# EAGLE design jsbx 11 main (EAGLE 6.2)
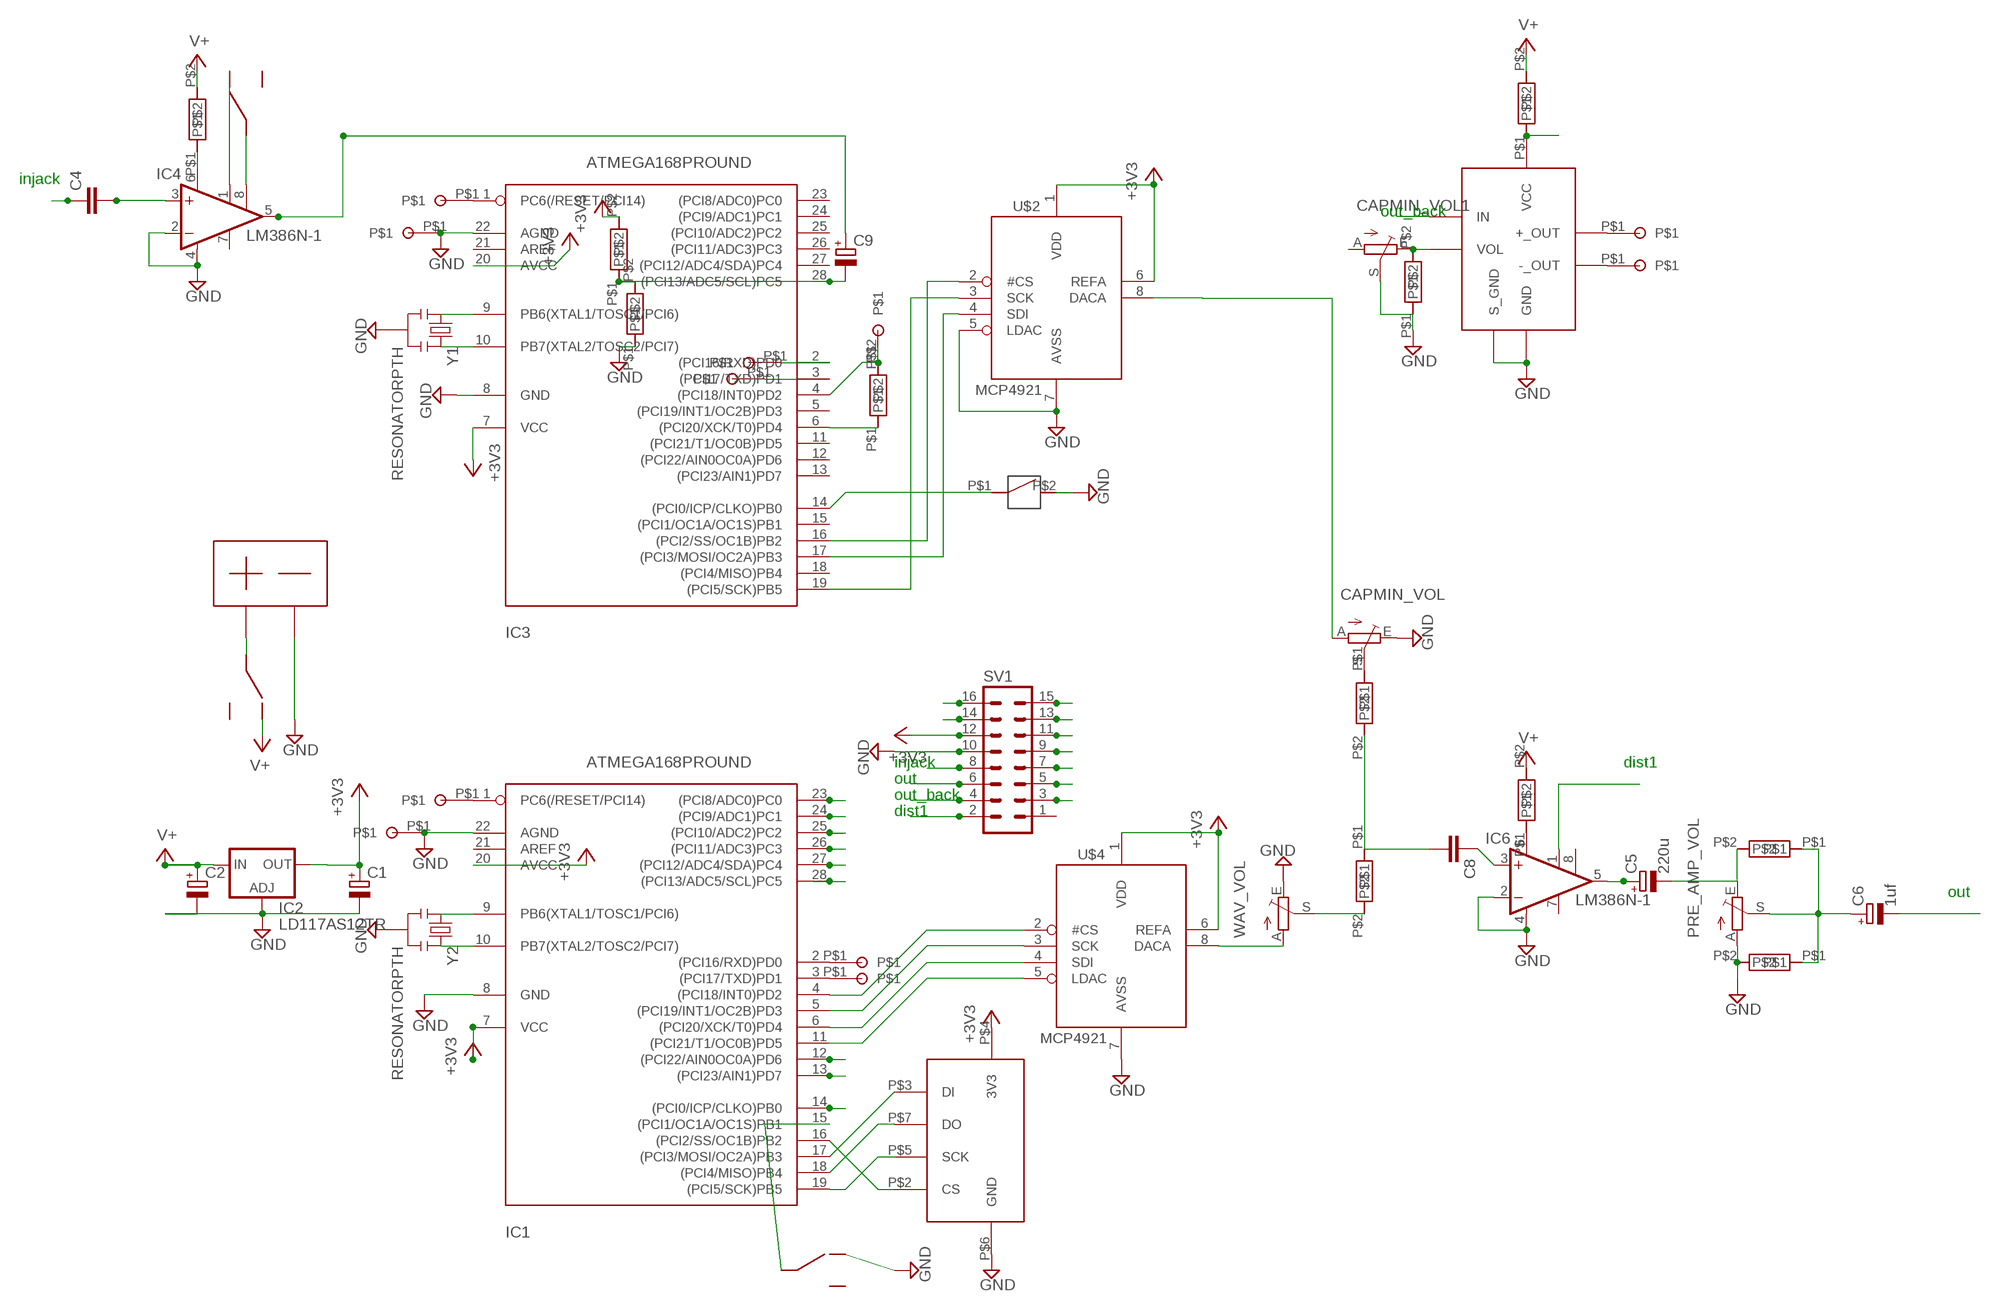
[diagram p0: schematic, sheet 1]

## Parts
C1  CPOL-EUE2-5  [E2-5]
C2  CPOL-EUE2-5  [E2-5]
C4  C-EU025-030X050  [C025-030X050]
C5  220u  CPOL-EUE2-5  [E2-5]
C6  1uf  CPOL-EUE2-5  [E2-5]
C8  C-EU025-030X050  [C025-030X050]
C9  CPOL-EUE2-5  [E2-5]
CAPMIN_VOL  TRIM_EU-CA9H  [CA9H]
CAPMIN_VOL1  TRIM_EU-CA9H  [CA9H]
IC1  ATMEGA168PROUND  [DIL28-3-ROUND]
IC2  LD117AS12TR  [SOT223]
IC3  ATMEGA168PROUND  [DIL28-3-ROUND]
IC4  LM386N-1  [DIL08]
IC6  LM386N-1  [DIL08]
PRE_AMP_VOL  TRIM_EU-CA9H  [CA9H]
R1  RESISTOR_PERP  [RESISTOR_PERP]
R2  RESISTOR_PERP  [RESISTOR_PERP]
R3  in_386_+  RESISTOR_PERP  [RESISTOR_PERP]
R4  10K  RESISTOR_PERP  [RESISTOR_PERP]
R4_DIS_386_+  RESISTOR_PERP  [RESISTOR_PERP]
R5  RESISTOR_PERP  [RESISTOR_PERP]
R6  RESISTOR_PERP  [RESISTOR_PERP]
R7  RESISTOR_PERP  [RESISTOR_PERP]
R8  RESISTOR_PERP  [RESISTOR_PERP]
R12-DIS_386_+1  RESISTOR_PERP  [RESISTOR_PERP]
R13-7052+  RESISTOR_PERP  [RESISTOR_PERP]
SV1  MA08-2  [MA08-2]
U$1  SD_MICRO_PERP  [SD_MICRO_PERP]
U$2  MCP4921  [DIL08]
U$3  TDA7052  [DIP8]
U$4  MCP4921  [DIL08]
U$5  SLIDE_HORIZ_OS  [SLIDE_HORIZ_OS]
U$6  12MM_TAC_HORIZ  [12MM_TAC_HORIZ]
U$7  PADSMALL  [PADSMALL]
U$8  PADSMALL  [PADSMALL]
U$9  PADSMALL  [PADSMALL]
U$10  PADSMALL  [PADSMALL]
U$11  PADSMALL  [PADSMALL]
U$12  PADSMALL  [PADSMALL]
U$13  PADSMALL  [PADSMALL]
U$14  PADSMALL  [PADSMALL]
U$15  PADSMALL  [PADSMALL]
U$16  SLIDE_HORIZ_OS  [SLIDE_HORIZ_OS]
U$17  SLIDE_HORIZ_OS  [SLIDE_HORIZ_OS]
U$18  9V  [9V]
U$22  PADSMALL  [PADSMALL]
U$23  PADSMALL  [PADSMALL]
WAV_VOL  TRIM_EU-CA9H  [CA9H]
Y1  RESONATORPTH  [RESONATOR-PTH]
Y2  RESONATORPTH  [RESONATOR-PTH]

## Nets
+3V3: C1.+ IC1.7(VCC) IC1.20(AVCC) IC2.4(OUT) IC3.7(VCC) IC3.20(AVCC) R2.P$2 SV1.12 U$1.P$4(3V3) U$2.1(VDD) U$2.6(REFA) U$4.1(VDD) U$4.6(REFA)
B1: IC1.28((PCI13/ADC5/SCL)PC5) SV1.14
DIST1: IC6.1(GAIN) SV1.2
GND: C1.- C2.- CAPMIN_VOL1.S CAPMIN_VOL.E IC1.8(GND) IC1.22(AGND) IC2.1(ADJ) IC3.8(GND) IC3.22(AGND) IC4.2(-IN) IC4.4(GND) IC6.2(-IN) IC6.4(GND) PRE_AMP_VOL.A R1.P$1 R6.P$2 R12-DIS_386_+1.P$1 SV1.10 U$1.P$6(GND) U$2.5(LDAC) U$2.7(AVSS) U$3.P$3(S_GND) U$3.P$6(GND) U$4.7(AVSS) U$6.P$2 U$11.P$1 U$13.P$1 U$16.P$2 U$18.P$2 WAV_VOL.E Y1.2 Y2.2
GPOT: IC1.23((PCI8/ADC0)PC0) SV1.9
IN_JACK: C4.1 SV1.8
N$1: IC1.10(PB7(XTAL2/TOSC2/PCI7)) Y2.3
N$2: IC1.9(PB6(XTAL1/TOSC1/PCI6)) Y2.1
N$3: IC3.10(PB7(XTAL2/TOSC2/PCI7)) Y1.3
N$4: IC3.9(PB6(XTAL1/TOSC1/PCI6)) Y1.1
N$5: IC1.18((PCI4/MISO)PB4) U$1.P$7(DO)
N$6: IC1.17((PCI3/MOSI/OC2A)PB3) U$1.P$3(DI)
N$7: IC1.19((PCI5/SCK)PB5) U$1.P$5(SCK)
N$8: IC1.16((PCI2/SS/OC1B)PB2) U$1.P$2(CS)
N$9: IC1.15((PCI1/OC1A/OC1S)PB1) U$16.P$1
N$10: IC1.4((PCI18/INT0)PD2) U$4.2(#CS)
N$11: IC1.5((PCI19/INT1/OC2B)PD3) U$4.3(SCK)
N$12: IC1.6((PCI20/XCK/T0)PD4) U$4.4(SDI)
N$13: IC1.11((PCI21/T1/OC0B)PD5) U$4.5(LDAC)
N$14: C8.1 IC6.3(+IN)
N$15: R8.P$2 WAV_VOL.S
N$16: IC4.6(VS) R3.P$1
N$17: IC1.2((PCI16/RXD)PD0) U$14.P$1
N$18: IC1.24((PCI9/ADC1)PC1) SV1.11
N$19: IC1.25((PCI10/ADC2)PC2) SV1.13
N$20: IC1.26((PCI11/ADC3)PC3) SV1.15
N$21: R13-7052+.P$1 U$3.P$1(VCC)
N$22: CAPMIN_VOL1.E R12-DIS_386_+1.P$2 U$3.P$4(VOL)
N$23: C9.- IC3.28((PCI13/ADC5/SCL)PC5) R1.P$2 R2.P$1
N$24: IC1.27((PCI12/ADC4/SDA)PC4) SV1.16
N$25: IC1.12((PCI22/AIN0OC0A)PD6) SV1.7
N$26: IC1.13((PCI23/AIN1)PD7) SV1.5
N$27: C4.2 IC4.3(+IN)
N$28: U$3.P$8(-_OUT) U$22.P$1
N$29: C8.2 R4.P$2 R8.P$1
N$30: IC4.1(GAIN) U$5.P$2
N$31: U$17.P$1 U$18.P$1
N$32: IC1.14((PCI0/ICP/CLKO)PB0) SV1.3
N$33: C5.- PRE_AMP_VOL.E R5.P$2
N$34: IC3.16((PCI2/SS/OC1B)PB2) U$2.2(#CS)
N$35: IC3.17((PCI3/MOSI/OC2A)PB3) U$2.4(SDI)
N$36: IC3.19((PCI5/SCK)PB5) U$2.3(SCK)
N$37: IC6.6(VS) R4_DIS_386_+.P$1
N$38: C5.+ IC6.5(OUT)
N$39: IC3.14((PCI0/ICP/CLKO)PB0) U$6.P$1
N$40: C9.+ IC4.5(OUT)
N$41: CAPMIN_VOL.A U$2.8(DACA)
N$42: IC3.1(PC6(/RESET/PCI14)) U$8.P$1
N$43: IC3.2((PCI16/RXD)PD0) U$9.P$1
N$44: IC3.3((PCI17/TXD)PD1) U$10.P$1
N$45: IC1.1(PC6(/RESET/PCI14)) U$12.P$1
N$46: IC1.3((PCI17/TXD)PD1) U$15.P$1
N$47: IC3.4((PCI18/INT0)PD2) R7.P$2 U$7.P$1
N$48: IC3.6((PCI20/XCK/T0)PD4) R7.P$1
N$49: U$3.P$5(+_OUT) U$23.P$1
N$50: IC4.8(GAIN) U$5.P$1
N$51: U$4.8(DACA) WAV_VOL.A
N$52: C6.+ PRE_AMP_VOL.S R5.P$1 R6.P$1
N$53: CAPMIN_VOL.S R4.P$1
OUT: C6.- SV1.6
OUT_BACK: SV1.4 U$3.P$2(IN)
V+: C2.+ IC2.3(IN) R3.P$2 R4_DIS_386_+.P$2 R13-7052+.P$2 U$17.P$2
Unconnected: CAPMIN_VOL1.A IC1.21(AREF) IC3.5((PCI19/INT1/OC2B)PD3) IC3.11((PCI21/T1/OC0B)PD5) IC3.12((PCI22/AIN0OC0A)PD6) IC3.13((PCI23/AIN1)PD7) IC3.15((PCI1/OC1A/OC1S)PB1) IC3.18((PCI4/MISO)PB4) IC3.21(AREF) IC3.23((PCI8/ADC0)PC0) IC3.24((PCI9/ADC1)PC1) IC3.25((PCI10/ADC2)PC2) IC3.26((PCI11/ADC3)PC3) IC3.27((PCI12/ADC4/SDA)PC4) IC4.7(BYPASS) IC6.7(BYPASS) IC6.8(GAIN) SV1.1 U$5.P$3 U$16.P$3 U$17.P$3

## Notes on the sheet
- injack
- out_back
- injack | dist1
- out
- out_back
- dist1
- out

## Library data of the parts
C1 C2 C5 C6 C9 = rcl:CPOL-EU: POLARIZED CAPACITOR, European symbol
C4 C8 = rcl:C-EU: CAPACITOR, European symbol
CAPMIN_VOL CAPMIN_VOL1 PRE_AMP_VOL WAV_VOL = pot:TRIM_EU-: POTENTIOMETER
IC1 IC3 = adafruit:ATMEGA168*P: MICROCONTROLLER 16 kBytes FLASH 1 kBytes SRAM 512 Bytes EEPROM USART 8-channel 10 bit ADC
IC2 = v-reg:LD117A?*: Low drop fixed and adjustable positive voltage regulators 1 A Source: http://www.st.com/stonline/products/literature/ds/7194/ld1117axx.pdf
IC4 IC6 = linear:LM386?-*: Low Voltage Audio Power Amplifier Source: http://cache.national.com/ds/LM/LM386.pdf
R1-R4 R4_DIS_386_+ R5-R8 R12-DIS_386_+1 R13-7052+ = bleep t2:RESISTOR_PERP
SV1 = con-lstb:MA08-2: PIN HEADER; OC_FARNELL: unknown; OC_NEWARK: unknown
U$1 = BLEEP:SD_MICRO_PERP
U$2 U$4 = adafruit:MCP4921
U$3 = BLEEP:TDA7052
U$5 U$16 U$17 = BLEEP:SLIDE_HORIZ_OS
U$6 = BLEEP:12MM_TAC_HORIZ
U$7-U$15 U$22 U$23 = bleep t2:PADSMALL
U$18 = bleep t2:9V
Y1 Y2 = SparkFun-FreqCtrl:RESONATOR: Resonator Small SMD resonator. This is the itty bitty 10/20MHz resonators with built in caps. CSTCE10M0G55 and CSTCE20M0V53. Footprint has been reviewed closely but hasn't been tested yet.

## Board
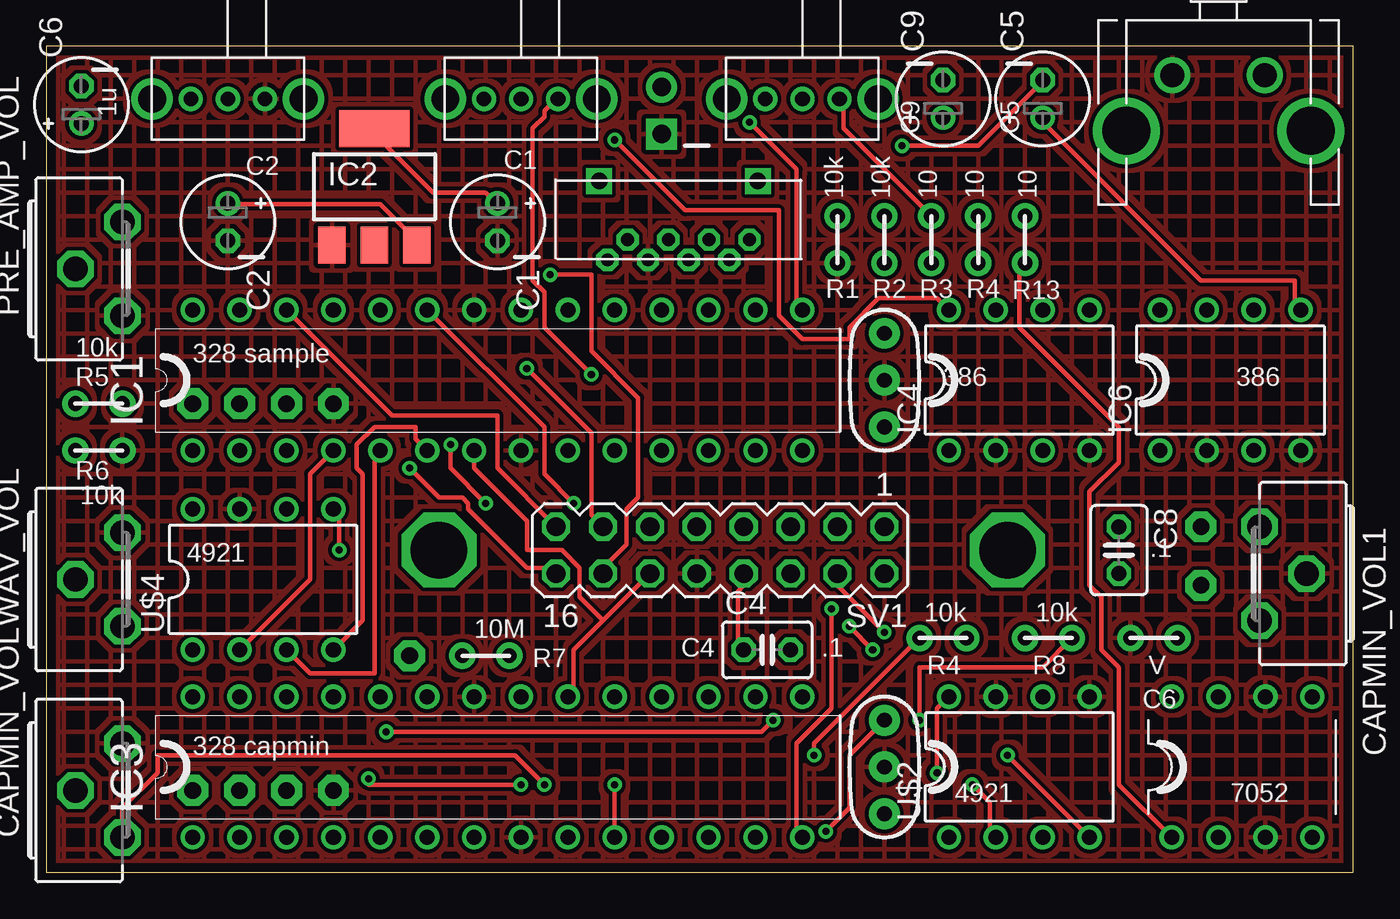
[diagram p1: board, top side]
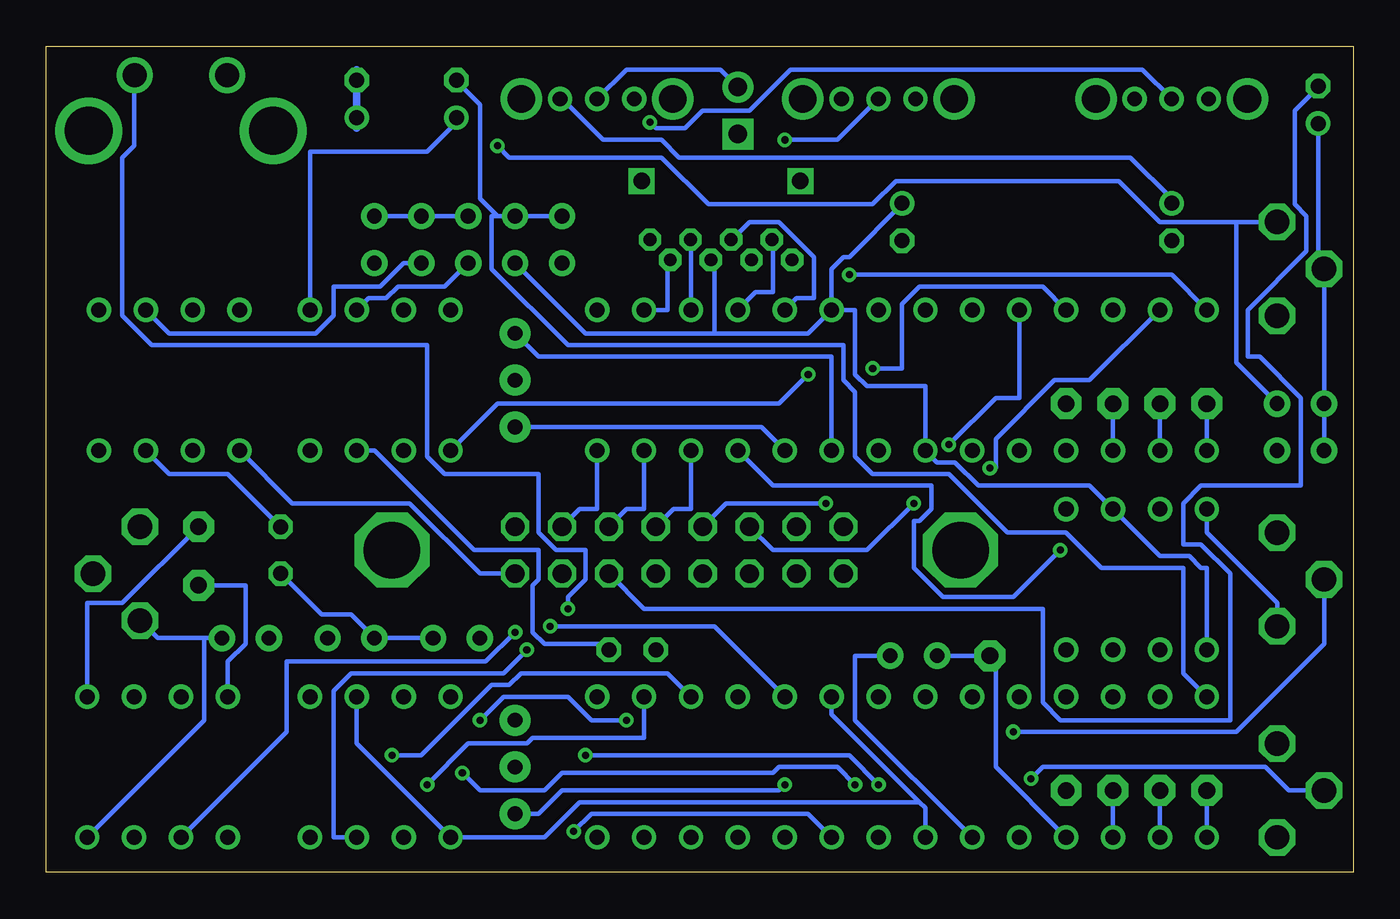
[diagram p2: board, bottom side, seen from below]

Size 70.8 x 44.77 mm. Coordinates in mm from the lower left corner, seen from the top.
Outline: 0,43.81 0,1.27 0,0 70.8,0 70.8,42.55 70.8,44.77 0,44.77 0,43.81
Copper layers (1*16): Top 0.035mm / dielectric 1.5mm / Bottom 0.035mm
Design rules: minimum track width 10mil, minimum drill 15mil, track to track 8mil, track to pad 8mil, pad to pad 8mil, via to via 8mil, smd to smd 8mil, copper to edge 20mil, drill to drill 8mil, minimum pad ring 10mil, minimum via ring 8mil, stop-mask expansion 4mil, vias tented up to drill 0mil, thermal gap 10mil

### Footprints (pad centres in the part's own frame; a part is rotated, then mirrored left to right if it is on the bottom)
E2-5 = drill 0.813 pad 1.27: + -1.016,0 | drill 0.813 pad 1.27 octagon: - 1.016,0
C025-030X050 = drill 0.813 octagon: 1 -1.27,0; 2 1.27,0
CA9H = drill 1.321 octagon: A -2.54,0; E 2.54,0; S 0,2.54
DIL28-3-ROUND = drill 0.813: 1 -16.51,-3.81; 2 -13.97,-3.81; 3 -11.43,-3.81; 4 -8.89,-3.81; 5 -6.35,-3.81; 6 -3.81,-3.81; 7 -1.27,-3.81; 8 1.27,-3.81; 9 3.81,-3.81; 10 6.35,-3.81; 11 8.89,-3.81; 12 11.43,-3.81; 13 13.97,-3.81; 14 16.51,-3.81; 15 16.51,3.81; 16 13.97,3.81; 17 11.43,3.81; 18 8.89,3.81; 19 6.35,3.81; 20 3.81,3.81; 21 1.27,3.81; 22 -1.27,3.81; 23 -3.81,3.81; 24 -6.35,3.81; 25 -8.89,3.81; 26 -11.43,3.81; 27 -13.97,3.81; 28 -16.51,3.81
SOT223 = smd 1.5 x 2: 1 -2.3,-3.15; 2 0,-3.15; 3 2.3,-3.15 | smd 3.8 x 2: 4 0,3.15
DIL08 = drill 0.813 pad 1.27: 1 -3.81,-3.81; 2 -1.27,-3.81; 3 1.27,-3.81; 4 3.81,-3.81; 5 3.81,3.81; 6 1.27,3.81; 7 -1.27,3.81; 8 -3.81,3.81
RESISTOR_PERP = drill 0.8 pad 1.422: P$1 0,0; P$2 2.54,0
MA08-2 = drill 1.016 octagon: 1 -8.89,-1.27; 2 -8.89,1.27; 3 -6.35,-1.27; 4 -6.35,1.27; 5 -3.81,-1.27; 6 -3.81,1.27; 7 -1.27,-1.27; 8 -1.27,1.27; 9 1.27,-1.27; 10 1.27,1.27; 11 3.81,-1.27; 12 3.81,1.27; 13 6.35,-1.27; 14 6.35,1.27; 15 8.89,-1.27; 16 8.89,1.27
SD_MICRO_PERP = drill 0.7 octagon: P$1 0,0; P$2 1.1,1.1; P$3 2.2,0; P$4 3.3,1.1; P$5 4.4,0; P$6 5.5,1.1; P$7 6.6,0; P$8 7.7,1.1 | drill 0.9 square: P$9 -0.45,-3.17; P$10 8.15,-3.17
DIL08' = drill 0.813: 1 -3.81,-3.81; 2 -1.27,-3.81; 3 1.27,-3.81; 4 3.81,-3.81; 5 3.81,3.81; 6 1.27,3.81; 7 -1.27,3.81; 8 -3.81,3.81
DIP8 = drill 0.813: P$1 0,0; P$2 2.54,0; P$3 5.08,0; P$4 7.62,0; P$5 7.62,7.62; P$6 5.08,7.62; P$7 2.54,7.62; P$8 0,7.62
SLIDE_HORIZ_OS = drill 0.8: P$1 0,0; P$2 2.007,0; P$3 -2.007,0 | drill 1.5 pad 2.032: P$4 4.102,0; P$5 -4.102,0
12MM_TAC_HORIZ = drill 1.3: P$1 0,2.5; P$2 0,-2.5 | drill 2.6: P$3 3,5; P$4 3,-5
PADSMALL = drill 0.9 pad 1.676 octagon: P$1 0,0
9V = drill 1 pad 1.676: P$1 0,0 | drill 1 pad 1.676 square: P$2 2.54,0
RESONATOR-PTH = drill 0.8 pad 1.676: 1 -2.54,0; 2 0,0; 3 2.54,0

### Placement (x,y rotation side)
C1  24.45,35.24 270 top
C2  9.84,35.24 270 top
C4  39.05,12.06 0 top
C5  53.97,41.91 90 top
C6  1.91,41.59 90 top
C8  58.1,17.46 270 top
C9  48.58,41.91 90 top
CAPMIN_VOL  4.13,4.45 90 top
CAPMIN_VOL1  65.72,16.19 270 top
IC1  24.45,26.67 0 top
IC2  17.78,37.15 0 top
IC3  24.45,5.71 0 top
IC4  52.7,26.67 0 top
IC6  64.14,26.67 0 top
PRE_AMP_VOL  4.13,32.7 90 top
R1  42.86,33.02 90 top
R2  45.4,35.56 270 top
R3  47.94,33.02 90 top
R4  47.31,12.7 0 top
R4_DIS_386_+  50.48,33.02 90 top
R5  1.59,25.4 0 top
R6  1.59,22.86 0 top
R7  25.08,11.75 180 top
R8  53.02,12.7 0 top
R12-DIS_386_+1  58.74,12.7 0 top
R13-7052+  53.02,33.02 90 top
SV1  36.51,17.46 180 top
U$1  38.1,34.29 180 top
U$2  MCP4921  [DIL08']  52.7,5.71 0 top
U$3  60.96,1.91 0 top
U$4  MCP4921  [DIL08']  11.75,15.88 0 top
U$5  25.72,41.91 0 top
U$6  63.5,43.18 270 top
U$7  19.69,11.75 0 top
U$8  7.94,4.45 0 top
U$9  10.48,4.45 0 top
U$10  13.02,4.45 0 top
U$11  15.56,4.45 0 top
U$12  7.94,25.4 0 top
U$13  15.56,25.4 0 top
U$14  10.48,25.4 0 top
U$15  13.02,25.4 0 top
U$16  9.84,41.91 0 top
U$17  40.96,41.91 0 top
U$18  33.34,42.55 270 top
U$22  62.55,15.56 0 top
U$23  62.55,18.73 0 top
WAV_VOL  4.13,15.88 90 top
Y1  45.4,5.71 270 top
Y2  45.4,26.67 270 top

### Tracks (layer width: path | path; a pad name or v marks a point on that pad's centre or on a via)
+3V3
  Top 0.254: 30.16,13.65 28.57,12.06 28.57,9.84 IC3.20 | 30.16,13.65 SV1.12 | IC2.4 17.78,40.01 20.96,36.83 23.81,36.83 24.45,36.2 C1.+ | 30.16,13.65 28.89,14.92 28.89,16.51 27.94,17.46 26.03,17.46 26.03,19.05 23.18,21.91 IC1.7
  Bottom 0.254: U$2.6 53.97,6.99 U$2.1 43.82,1.91 41.91,3.81 23.49,3.81 | IC3.7 23.18,3.49 23.49,3.81 | 23.49,3.81 28.26,8.57 IC3.20 | U$4.1 7.94,16.51 8.25,16.51 8.89,17.14 10.48,17.14 U$4.6 14.29,20.95 20.32,20.95 21.59,22.23 22.54,22.23 IC1.7 23.18,26.35 26.35,26.35 26.99,26.99 26.99,30.48 IC1.20 | 34.61,29.21 34.61,33.02 U$1.P$4 | 34.61,29.21 29.53,29.21 IC1.20 | IC1.20 28.26,32.7 27.62,33.34 27.3,33.34 24.45,36.2 C1.+ | R2.P$2 41.59,29.21 34.61,29.21
B1  (via drill 0.38)
  Top 0.254: v27.3,32.38 29.53,32.38 29.53,28.26 32.07,25.72 32.07,20.32 31.43,19.68 31.43,17.78 30.16,16.51 SV1.14
  Bottom 0.254: IC1.28 9.84,32.38 v27.3,32.38
DIST1
  Bottom 0.254: IC6.1 57.47,20 51.12,20 47.31,16.19 SV1.2
GND
  pour Top (hatched): -2.22,48.26 72.71,46.99 73.98,-2.54 -2.22,-0.64
GPOT  (via drill 0.38)
  Top 0.254: IC1.23 26.99,24.13 26.99,21.59 v28.57,20
  Bottom 0.254: v28.57,20 33.97,20 SV1.9
IN_JACK
  Top 0.254: C4.1 37.46,12.38 37.46,15.24 37.78,15.56 SV1.8
N$1
  Bottom 0.254: IC1.10 32.07,24.13 Y2.3
N$2
  Bottom 0.254: IC1.9 28.26,27.94 44.13,27.94 Y2.1
N$3  (via drill 0.38)
  Top 0.254: v30.8,4.76 IC3.10
  Bottom 0.254: v30.8,4.76 31.12,4.45 42.86,4.45 44.13,3.17 Y1.3
N$4  (via drill 0.38)
  Top 0.254: v42.23,2.22 43.5,3.49 43.5,6.35 Y1.1
  Bottom 0.254: IC3.9 29.53,3.17 41.28,3.17 v42.23,2.22
N$5
  Bottom 0.254: IC1.18 32.39,31.43 31.43,31.43 31.43,34.29 U$1.P$7
N$6
  Bottom 0.254: IC1.17 35.88,34.29 U$1.P$3
N$7
  Bottom 0.254: IC1.19 30.16,31.11 29.21,31.11 29.21,33.34 31.12,35.24 32.7,35.24 33.65,34.29 U$1.P$5
N$8
  Bottom 0.254: IC1.16 37.15,30.48 37.15,33.02 U$1.P$2
N$9  (via drill 0.38)
  Top 0.254: v38.1,40.64 40.64,38.1 40.64,30.8 IC1.15
  Bottom 0.254: U$16.P$1 11.43,43.5 30.48,43.5 32.7,41.27 35.24,41.27 36.2,40.32 37.78,40.32 v38.1,40.64
N$10
  Top 0.254: U$4.2 14.29,15.88 14.29,21.59 IC1.4
N$11
  Top 0.254: U$4.3 14.29,10.79 17.78,10.79 17.78,22.54 IC1.5
N$12
  Top 0.254: U$4.4 17.14,13.65 17.14,21.59 16.83,21.91 16.83,23.18 17.78,24.13 20,24.13 20,23.5 IC1.6
N$13  (via drill 0.38)
  Top 0.254: U$4.5 15.87,19.37 v15.87,17.46
  Bottom 0.254: v15.87,17.46 18.42,14.92 22.23,14.92 23.81,16.51 23.81,19.05 23.49,19.05 22.86,19.68 22.86,20.95 31.43,20.95 IC1.11
N$14
  Bottom 0.254: C8.1 60.96,21.59 64.14,21.59 IC6.3
N$15  (via drill 0.38)
  Top 0.254: R8.P$2 53.97,11.11 47.31,11.11 v47.31,8.26 | v39.37,8.26 38.74,7.62 v18.42,7.62
  Bottom 0.254: v47.31,8.26 46.04,9.53 42.54,9.53 41.28,8.26 v39.37,8.26 | v18.42,7.62 18.1,7.62 6.35,7.62 1.59,12.38 WAV_VOL.S
N$16
  Bottom 0.254: IC4.6 53.34,31.11 52.39,31.11 51.75,31.75 49.21,31.75 R3.P$1
N$17
  Bottom 0.254: U$14.P$1 IC1.2
N$18  (via drill 0.38)
  Top 0.254: v21.91,23.18 21.91,21.91 v23.81,20
  Bottom 0.254: IC1.24 18.1,25.72 19.37,25.72 v21.91,23.18 | v23.81,20 26.35,17.46 31.43,17.46 SV1.11
N$19  (via drill 0.38)
  Top 0.254: v26.03,27.3 29.53,23.81 29.53,19.37 SV1.13
  Bottom 0.254: IC1.25 16.83,31.75 23.49,31.75 24.45,30.8 24.45,27.3 v26.03,27.3
N$20
  Top 0.254: IC1.26 18.73,24.77 24.45,24.77 24.45,21.91 SV1.15
N$21
  Top 0.254: U$3.P$1 58.1,4.76 58.1,11.11 57.15,12.06 57.15,14.92 56.52,15.56 56.52,20.64 58.1,22.23 58.1,24.13 52.71,29.53 52.71,32.7 R13-7052+.P$1
N$22
  Bottom 0.254: U$3.P$4 62.23,8.26 62.23,12.7 | R12-DIS_386_+1.P$2 62.23,12.7 | CAPMIN_VOL1.E 64.77,12.7 62.23,12.7
N$23
  Bottom 0.254: IC3.28 9.21,10.79 9.21,16.51 13.65,16.51 15.56,18.41 18.73,18.41 21.91,21.59 26.03,21.59 26.99,22.54 26.99,26.04 27.62,26.67 27.62,28.57 42.54,28.57 46.67,32.7 46.67,35.56 46.35,35.56 | 46.35,35.56 R2.P$1 R1.P$2 | 46.35,35.56 47.31,36.51 47.31,41.59 48.58,42.86 C9.-
N$24  (via drill 0.38)
  Top 0.254: v19.69,21.91 21.27,20.32 22.54,20.32 22.86,20 22.86,19.68 26.03,16.51 27.62,16.51 SV1.16
  Bottom 0.254: IC1.27 14.29,26.67 16.19,26.67 19.37,23.5 19.37,21.91 v19.69,21.91
N$25
  Bottom 0.254: IC1.12 35.88,19.68 36.83,19.68 SV1.7
N$26
  Bottom 0.254: IC1.13 38.42,19.68 39.37,19.68 SV1.5
N$27
  Bottom 0.254: C4.2 40.64,12.38 43.82,12.38 44.45,13.02 44.45,15.56 44.13,15.88 44.13,17.46 47.63,17.46 53.02,22.86 IC4.3
N$28
  Bottom 0.254: U$3.P$8 60.96,11.43 60.01,12.38 60.01,15.56 U$22.P$1
N$29
  Bottom 0.254: C8.2 55.88,13.97 54.29,13.97 R8.P$1 R4.P$2
N$30  (via drill 0.38)
  Top 0.254: v29.53,26.99 26.99,29.53 26.99,31.43 26.35,32.07 26.35,40.32 26.99,40.96 26.99,41.27 27.62,41.91 U$5.P$2
  Bottom 0.254: v29.53,26.99 31.12,25.4 46.35,25.4 IC4.1
N$31
  Bottom 0.254: U$17.P$1 39.37,43.5 34.29,43.5 U$18.P$1
N$32
  Bottom 0.254: IC1.14 40.96,19.68 41.91,19.68 SV1.3
N$33  (via drill 0.38)
  Top 0.254: v46.35,39.37 50.48,39.37 53.97,42.86 C5.-
  Bottom 0.254: v46.35,39.37 45.72,38.73 37.46,38.73 34.92,36.2 26.03,36.2 24.76,37.47 12.7,37.47 10.48,35.24 6.35,35.24 | PRE_AMP_VOL.E 6.35,35.24 | R5.P$2 6.35,27.62 6.35,35.24
N$34  (via drill 0.38)
  Top 0.254: v50.17,4.76 51.12,3.81 51.12,2.22 U$2.2
  Bottom 0.254: IC3.16 38.42,7.3 44.45,7.3 44.77,6.99 47.94,6.99 v50.17,4.76
N$35  (via drill 0.38)
  Top 0.254: U$2.4 v52.07,6.35
  Bottom 0.254: IC3.17 37.15,10.79 45.09,10.79 45.72,10.16 46.67,10.16 50.48,6.35 v52.07,6.35
N$36  (via drill 0.38)
  Top 0.254: v44.77,12.06 v43.5,13.34
  Bottom 0.254: IC3.19 34.61,13.34 v43.5,13.34 | v44.77,12.06 46.04,10.79 54.29,10.79 55.24,9.84 55.24,1.91 U$2.3
N$37
  Bottom 0.254: IC6.6 64.14,29.21 56.2,29.21 55.24,30.16 55.24,31.75 52.71,31.75 51.43,33.02 R4_DIS_386_+.P$1
N$38
  Top 0.254: IC6.5 67.63,30.8 67.63,32.07 62.55,32.07 53.97,40.64 C5.+
N$39  (via drill 0.38)
  Top 0.254: IC3.14 40.64,2.22 40.64,6.99 42.54,8.89 v42.54,14.29
  Bottom 0.254: v42.54,14.29 42.54,14.92 41.59,15.88 41.59,17.46 43.18,17.46 44.13,18.41 44.13,21.59 49.21,21.59 50.17,22.54 50.17,28.57 65.09,28.57 66.68,30.16 66.68,38.73 66.04,39.37 66.04,43.18 U$6.P$1
N$40
  Bottom 0.254: IC4.5 56.52,39.05 50.17,39.05 48.58,40.64 C9.+
N$41  (via drill 0.38)
  Top 0.254: U$2.8 48.26,8.89 v48.26,5.4 | v26.99,4.76 25.4,6.35 6.03,6.35 6.03,5.4 4.13,3.49 CAPMIN_VOL.A
  Bottom 0.254: v48.26,5.4 47.31,4.45 43.82,4.45 42.86,5.4 31.43,5.4 31.12,5.71 27.94,5.71 v26.99,4.76
N$42
  Bottom 0.254: U$8.P$1 IC3.1
N$43
  Bottom 0.254: U$9.P$1 IC3.2
N$44
  Bottom 0.254: U$10.P$1 IC3.3
N$45
  Bottom 0.254: U$12.P$1 IC1.1
N$46
  Bottom 0.254: U$15.P$1 IC1.3
N$47
  Bottom 0.254: IC3.4 19.37,5.71 19.37,11.75 U$7.P$1 R7.P$2
N$48
  Bottom 0.254: IC3.6 26.99,8.26 26.99,11.75 R7.P$1
N$49
  Bottom 0.254: U$3.P$5 68.58,14.61 66.68,14.61 U$23.P$1
N$50  (via drill 0.38)
  Top 0.254: v30.8,39.69 34.61,35.88 39.69,35.88 39.69,30.16 40.96,28.89 43.5,28.89 43.5,29.53 45.09,31.11 48.26,31.11 IC4.8
  Bottom 0.254: U$5.P$1 27.94,39.69 v30.8,39.69
N$51
  Bottom 0.254: U$4.8 7.94,18.41 4.13,14.61 WAV_VOL.A
N$52
  Bottom 0.254: R6.P$1 R5.P$1 PRE_AMP_VOL.S 1.91,32.7 1.91,40.32 C6.+
N$53  (via drill 0.38)
  Top 0.254: R4.P$1 41.59,6.99 v41.59,6.35 | v25.72,4.76 17.46,4.76 v17.46,5.08
  Bottom 0.254: v41.59,6.35 27.3,6.35 v25.72,4.76 | v17.46,5.08 16.83,5.71 4.76,5.71 3.49,4.45 CAPMIN_VOL.S
N$55
  Bottom 0.406: 53.97,43.5 53.97,40.32
N$4000  (via drill 3.05)
  other vias: 21.27,17.46
N$5400  (via drill 3.05)
  other vias: 52.07,17.46
OUT
  Bottom 0.254: SV1.6 38.42,14.29 16.83,14.29 16.83,9.21 15.87,8.26 6.67,8.26 6.67,16.19 8.25,17.78 9.21,17.78 9.21,20 8.25,20.95 2.86,20.95 2.86,25.72 5.08,27.94 5.71,27.94 5.71,30.48 2.54,33.66 2.54,35.56 3.18,36.2 3.18,41.27 1.91,42.55 C6.-
OUT_BACK  (via drill 0.38)
  Top 0.254: v45.4,13.02 42.86,15.56 SV1.4
  Bottom 0.254: U$3.P$2 57.78,7.62 57.78,11.43 46.99,11.43 v45.4,13.02
V+
  Top 0.254: IC2.3 20,34.29 18.1,36.2 9.84,36.2 C2.+ | R3.P$2 43.18,40.32 43.18,41.91 U$17.P$2
  Bottom 0.254: R3.P$2 R4_DIS_386_+.P$2 R13-7052+.P$2 | C2.+ 9.84,36.51 12.07,38.73 36.51,38.73 37.46,39.69 40.64,39.69 42.86,41.91 U$17.P$2

### Text on the board
tSilk: R7 | R6 | R5 | R8 | C5 | 220 | R3 | 7052 | 386 | EXPLODER2A | C3 | 4901 | 386 | C4 | R4 | R1 | C12 | 4901 | R2
note1: CAPMIN to amp | post mix into dist | input | capmin r | input to amp | in_out | capmin out | key out | input to adc | KEYS to amp | to gnd
_tsilk: 1u | C9 | C5 | C2 | C1 | 10k | 10k | 10 | 10 | 10 | R13 | R1 | R2 | R3 | R4 | 10k | 328 sample | R5 | 386 | 386 | R6 | 10k | .1 | 4921 | 10k | 10k | 10M | C4 | .1 | R4 | R8 | V | R7 | C6 | 328 capmin | 4921 | 7052